# EAGLE design pcb_control_m128 (EAGLE 7.4.0)
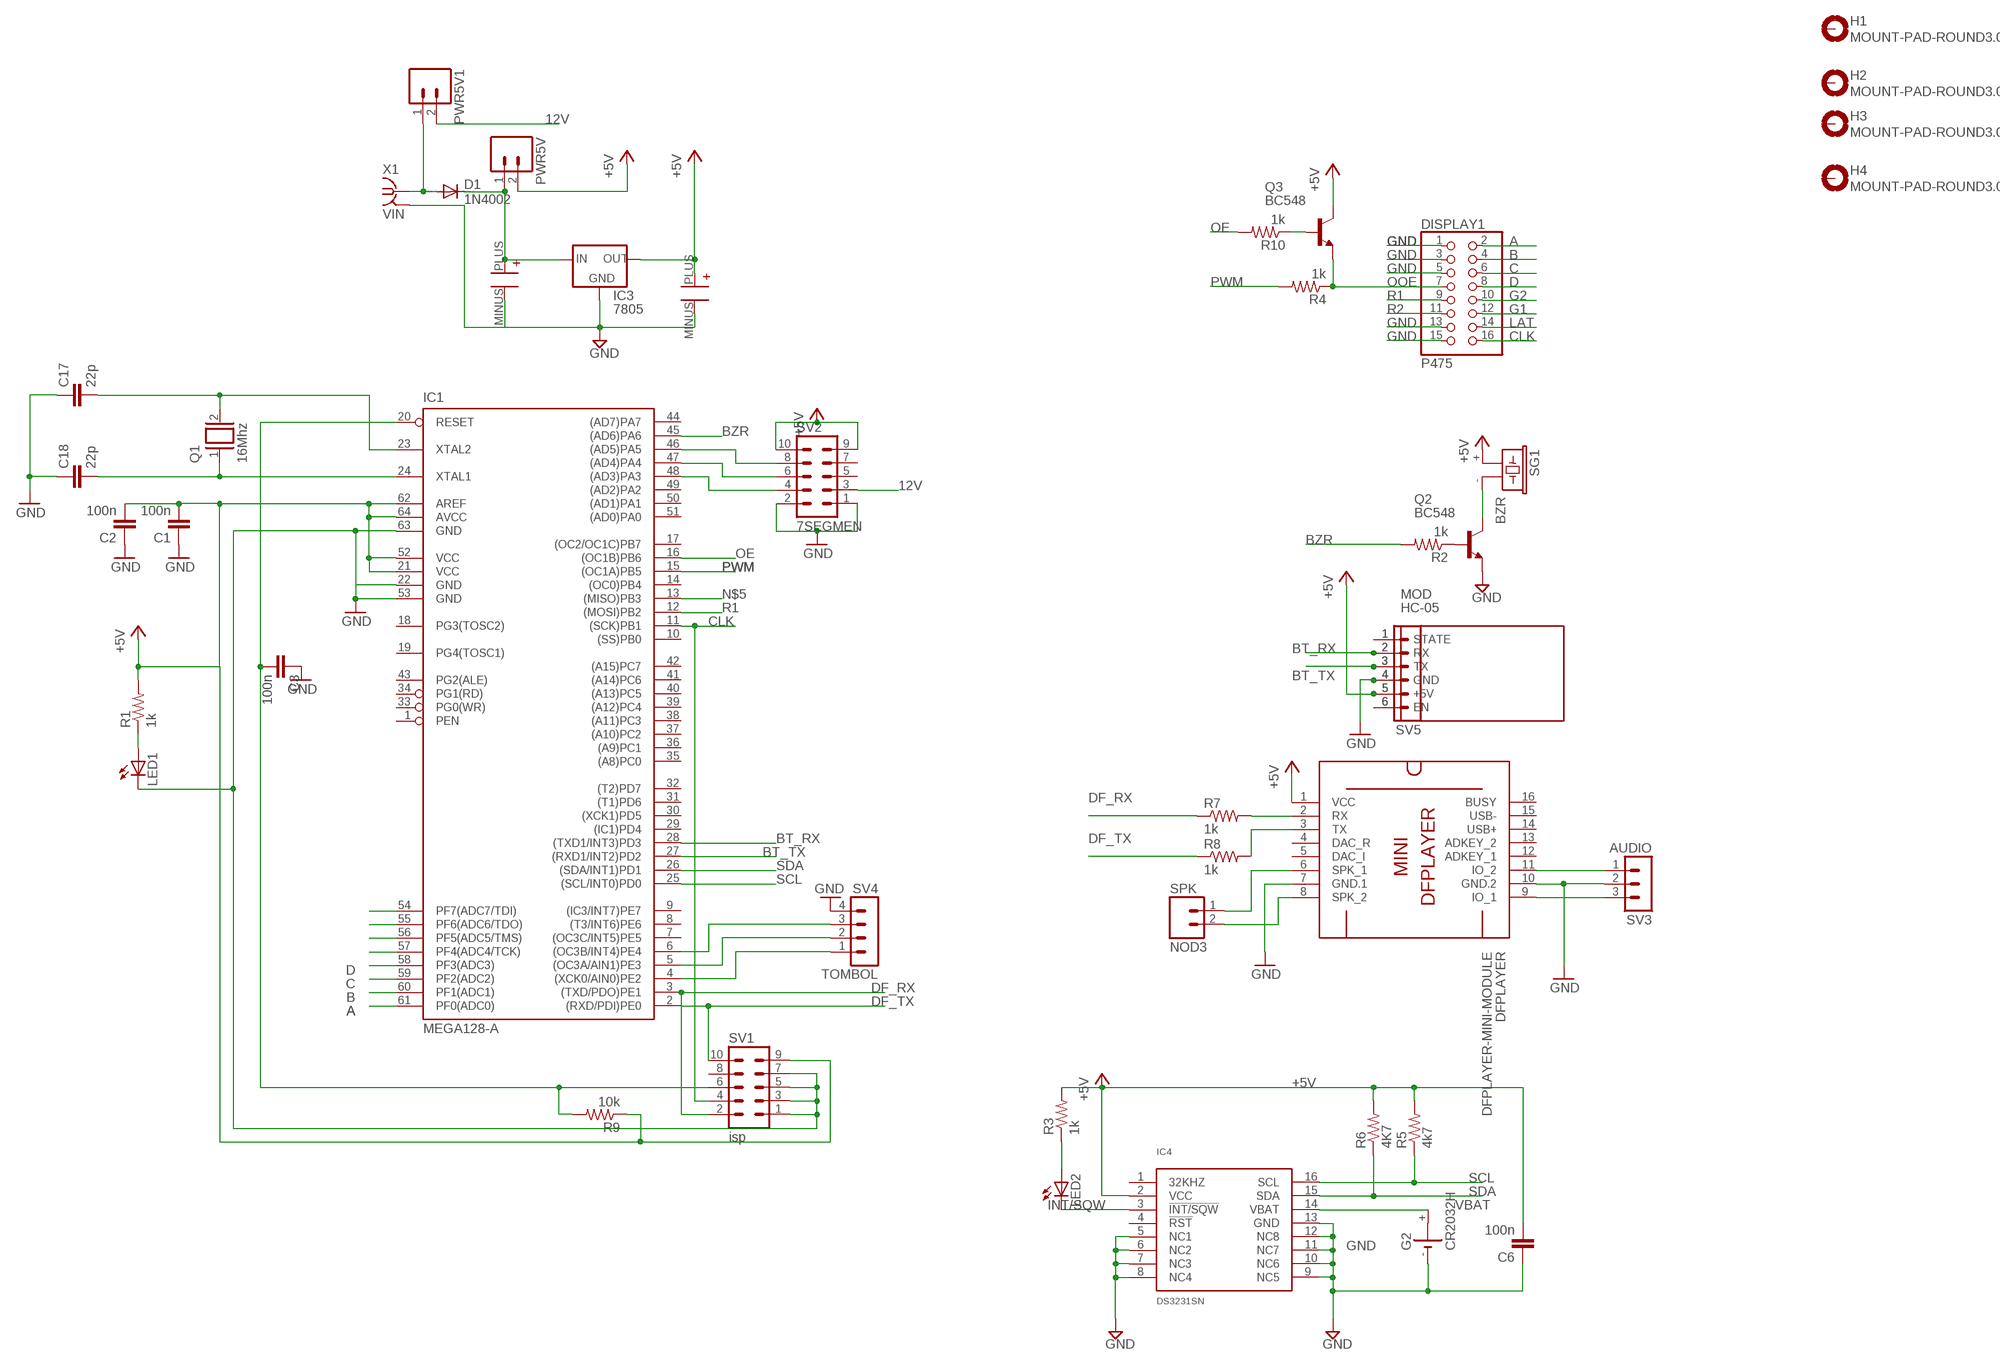
[diagram p0: schematic, sheet 1]

## Parts
C1  100n  C-EU025-024X044  [C025-024X044]
C2  100n  C-EU025-024X044  [C025-024X044]
C3  100n  C-EU025-024X044  [C025-024X044]
C6  100n  C-EU025-024X044  [C025-024X044]
C17  22p  C-EU025-024X044  [C025-024X044]
C18  22p  C-EU025-024X044  [C025-024X044]
C23  470U  EEU-FR1C471B  [EEU-FR1C471B]
C24  1000U  EEU-FR1C471B  [EEU-FR1C471B]
D1  1N4002  1N4148DO35-10  [DO35-10]
DFPLAYER  DFPLAYER-MINI-MODULE  [DFPLAYER-MINI-MODULE]
DISPLAY1  P475  PINHD-2X8  [2X08]
G2  CR2032H  [CR2032H]
H1  MOUNT-PAD-ROUND3.0  [3,0-PAD]
H2  MOUNT-PAD-ROUND3.0  [3,0-PAD]
H3  MOUNT-PAD-ROUND3.0  [3,0-PAD]
H4  MOUNT-PAD-ROUND3.0  [3,0-PAD]
IC1  MEGA128-A  [TQFP64]
IC3  7805  78XXS  [78XXS]
IC4  DS3231SN  [SO16W]
LED1  LED3MM  [LED3MM]
LED2  LED3MM  [LED3MM]
MOD  HC-05  WIRELESS-BLUETOOTH-HC-05  [WIRELESS-BLUETOOTH-HC-05]
NOD3  SPK  M02PTH  [1X02]
PWR5V  M02PTH  [1X02]
PWR5V1  M02PTH  [1X02]
Q1  16Mhz  XTAL/S  [QS]
Q2  BC548  [TO92-EBC]
Q3  BC548  [TO92-EBC]
R1  1k  RESISTORAXIAL-0.3  [AXIAL-0.3]
R2  1k  RESISTORAXIAL-0.3  [AXIAL-0.3]
R3  1k  RESISTORAXIAL-0.3  [AXIAL-0.3]
R4  1k  RESISTORAXIAL-0.3  [AXIAL-0.3]
R5  4k7  RESISTORAXIAL-0.3  [AXIAL-0.3]
R6  4K7  RESISTORAXIAL-0.3  [AXIAL-0.3]
R7  1k  RESISTORAXIAL-0.3  [AXIAL-0.3]
R8  1k  RESISTORAXIAL-0.3  [AXIAL-0.3]
R9  10k  RESISTORAXIAL-0.3  [AXIAL-0.3]
R10  1k  RESISTORAXIAL-0.3  [AXIAL-0.3]
SG1  BZR  F/CM12P  [F/CM12P]
SV1  isp  MA05-2  [MA05-2]
SV2  7SEGMEN  MA05-2  [MA05-2]
SV3  AUDIO  MA03-1  [MA03-1]
SV4  TOMBOL  MA04-1  [MA04-1]
SV5  MA06-1  [MA06-1]
X1  VIN  SMA-J502-ND  [J502-ND]

## Nets
5VPANEL [SUPPLYP]: C24.PLUS D1.C IC3.IN PWR5V.1
12V: PWR5V1.2 SV2.3
12V1: D1.A PWR5V1.1 X1.3 X1.4
+5V: C1.2 C2.2 C6.2 C23.PLUS DFPLAYER.1(VCC) IC1.21(VCC) IC1.52(VCC) IC1.62(AREF) IC1.64(AVCC) IC3.OUT IC4.2(VCC) MOD.5(+5V) PWR5V.2 Q3.C R1.P$2 R3.P$2 R5.P$2 R6.P$2 R9.P$1 SG1.+ SV1.9 SV2.9 SV2.10 SV5.5
A: DISPLAY1.2 IC1.61(PF0(ADC0))
B: DISPLAY1.4 IC1.60(PF1(ADC1))
BT_RX: IC1.28((TXD1/INT3)PD3) MOD.2(RX) SV5.2
BT_TX: IC1.27((RXD1/INT2)PD2) MOD.3(TX) SV5.3
BZR: IC1.45((AD6)PA6) R2.P$2
C: DISPLAY1.6 IC1.59(PF2(ADC2))
CLK: DISPLAY1.16 IC1.11((SCK)PB1) SV1.4
D: DISPLAY1.8 IC1.58(PF3(ADC3))
DF_RX: IC1.3((TXD/PDO)PE1) R7.P$1 SV1.2
DF_TX: IC1.2((RXD/PDI)PE0) R8.P$1 SV1.10
G1: DISPLAY1.12
G2: DISPLAY1.10
GND: C1.1 C2.1 C3.1 C6.1 C17.1 C18.1 C23.MINUS C24.MINUS DFPLAYER.7(GND.1) DFPLAYER.10(GND.2) DISPLAY1.1 DISPLAY1.3 DISPLAY1.5 DISPLAY1.13 DISPLAY1.15 G2.- IC1.22(GND) IC1.53(GND) IC1.63(GND) IC3.GND IC4.5(NC1) IC4.6(NC2) IC4.7(NC3) IC4.8(NC4) IC4.9(NC5) IC4.10(NC6) IC4.11(NC7) IC4.12(NC8) IC4.13(GND) LED1.K(C) MOD.4(GND) Q2.E SV1.1 SV1.3 SV1.5 SV1.7 SV2.1 SV2.2 SV3.2 SV4.4 SV5.4 X1.2 X1.5
INT/SQW: IC4.3(!INT/SQW) LED2.K(C)
LAT: DISPLAY1.14 IC1.57(PF4(ADC4/TCK))
N$1: Q2.B R2.P$1
N$2: Q2.C SG1.-
N$3: LED2.A R3.P$1
N$4: C3.2 IC1.20(RESET) R9.P$2 SV1.6
N$5: IC1.13((MISO)PB3)
N$6: MOD.1(STATE) SV5.1
N$7: LED1.A R1.P$1
N$8: DFPLAYER.2(RX) R7.P$2
N$9: DFPLAYER.3(TX) R8.P$2
N$10: Q3.B R10.P$1
N$11: MOD.6(EN) SV5.6
N$12: IC1.48((AD3)PA3) SV2.4
N$13: IC1.47((AD4)PA4) SV2.6
N$14: IC1.46((AD5)PA5) SV2.8
N$15: IC1.4((XCK0/AIN0)PE2) SV4.1
N$16: IC1.5((OC3A/AIN1)PE3) SV4.2
N$18: IC1.6((OC3B/INT4)PE4) SV4.3
N$21: DFPLAYER.6(SPK_1) NOD3.1
N$22: DFPLAYER.8(SPK_2) NOD3.2
N$23: DFPLAYER.9(IO_1) SV3.3
N$24: DFPLAYER.11(IO_2) SV3.1
N$59: IC1.56(PF5(ADC5/TMS))
N$60: IC1.55(PF6(ADC6/TDO))
N$61: IC1.54(PF7(ADC7/TDI))
N$95 [OSC]: C17.2 IC1.23(XTAL2) Q1.2
N$96 [OSC]: C18.2 IC1.24(XTAL1) Q1.1
OE: IC1.16((OC1B)PB6) R10.P$2
OOE: DISPLAY1.7 Q3.E R4.P$1
PWM: IC1.15((OC1A)PB5) R4.P$2
R1: DISPLAY1.9 IC1.12((MOSI)PB2)
R2: DISPLAY1.11
SCL: IC1.25((SCL/INT0)PD0) IC4.16(SCL) R5.P$1
SDA: IC1.26((SDA/INT1)PD1) IC4.15(SDA) R6.P$1
VBAT: G2.+ IC4.14(VBAT)
Unconnected: DFPLAYER.4(DAC_R) DFPLAYER.5(DAC_I) DFPLAYER.12(ADKEY_1) DFPLAYER.13(ADKEY_2) DFPLAYER.14(USB+) DFPLAYER.15(USB-) DFPLAYER.16(BUSY) H1.B3,0(MOUNT) H2.B3,0(MOUNT) H3.B3,0(MOUNT) H4.B3,0(MOUNT) IC1.1(PEN) IC1.7((OC3C/INT5)PE5) IC1.8((T3/INT6)PE6) IC1.9((IC3/INT7)PE7) IC1.10((SS)PB0) IC1.14((OC0)PB4) IC1.17((OC2/OC1C)PB7) IC1.18(PG3(TOSC2)) IC1.19(PG4(TOSC1)) IC1.29((IC1)PD4) IC1.30((XCK1)PD5) IC1.31((T1)PD6) IC1.32((T2)PD7) IC1.33(PG0(WR)) IC1.34(PG1(RD)) IC1.35((A8)PC0) IC1.36((A9)PC1) IC1.37((A10)PC2) IC1.38((A11)PC3) IC1.39((A12)PC4) IC1.40((A13)PC5) IC1.41((A14)PC6) IC1.42((A15)PC7) IC1.43(PG2(ALE)) IC1.44((AD7)PA7) IC1.49((AD2)PA2) IC1.50((AD1)PA1) IC1.51((AD0)PA0) IC4.1(32KHZ) IC4.4(!RST) SV1.8 SV2.5 SV2.7

## Library data of the parts
C1-C3 C6 C17 C18 = rcl:C-EU: CAPACITOR, European symbol
C23 C24 = my:EEU-FR1C471B
D1 = diode:1N4148: DIODE high speed (Philips)
DFPLAYER = diy-modules:DFPLAYER-MINI-MODULE: DFPlayer Mini - MP3 player module based on YX5200 chip More details available here: https://www.dfrobot.com/wiki/index.php/DFPlayer_Mini_SKU:DFR0299 Click here to find device on ebay.com <http://www.ebay.com/sch/dfplayer+mini>
DISPLAY1 = pinhead:PINHD-2X8: PIN HEADER
G2 = battery_cr2032:CR2032H: LI BATTERY Varta
H1-H4 = holes:MOUNT-PAD-ROUND: MOUNTING PAD, round
IC1 = atmel:MEGA128: MICROCONTROLLER 128 Kbytes FLASH 4 Kbytes SRAM 4 Kbytes EEPROM DUAL USART 8-channel 10 bit ADC Source: avr.lbr; MPN: ATMEGA128-16AU; OC_FARNELL: 9171118; OC_NEWARK: 95K7364
IC3 = v-reg:78XXS: VOLTAGE REGULATOR
IC4 = comfile:DS3231SN
LED1 LED2 = adafruit:LED: LED OSRAM: - CHIPLED LG R971, LG N971, LY N971, LG Q971, LY Q971, LO R971, LY R971 LH N974, LH R974 LS Q976, LO Q976, LY Q976 LO Q996 - Hyper CHIPLED LW Q18S LB Q993, LB Q99A, LB R99A - SideLED LS A670, LO A670, LY A670, LG A670, LP A670 LB A673, LV A673, LT A673, LW A673 LH A674 LY A675 LS A676, LA A676, LO A676, LY A676, LW A676 LS A679, LY A679, LG A679 - Hyper Micro SIDELED® LS Y876, LA Y876, LO Y876, LY Y876 LT Y87S - SmartLED LW L88C, LW L88S LB L89C, LB L89S, LG L890 LS L89K, LO L89K, LY L89K LS L896, LA L896, LO L896, LY L896 - TOPLED LS T670, LO T670, LY T670, LG T670, LP T670 LSG T670, LSP T670, LSY T670, LOP T670, LYG T670 LG T671, LOG T671, LSG T671 LB T673, LV T673, LT T673, LW T673 LH T674 LS T676, LA T676, LO T676, LY T676, LB T676, LH T676, LSB T676, LW T676 LB T67C, LV T67C, LT T67C, LS T67K, LO T67K, LY T67K, LW E67C LS E67B, LA E67B, LO E67B, LY E67B, LB E67C, LV E67C, LT E67C LW T67C LS T679, LY T679, LG T679 LS T770, LO T770, LY T770, LG T770, LP T770 LB T773, LV T773, LT T773, LW T773 LH T774 LS E675, LA E675, LY E675, LS T675 LS T776, LA T776, LO T776, LY T776, LB T776 LHGB T686 LT T68C, LB T68C - Hyper Mini TOPLED® LB M676 - Mini TOPLED Santana® LG M470 LS M47K, LO M47K, LY M47K Source: http://www.osram.convergy.de/
MOD = diy-modules:WIRELESS-BLUETOOTH-HC-05: Bluetooth Transceiver Module based on HC-05 board Tutorial is available here: https://arduino-info.wikispaces.com/BlueTooth-HC05-HC06-Modules-How-To Click here to find device on ebay.com <http://www.ebay.com/sch/hc-05+module+rs232>
NOD3 PWR5V PWR5V1 = SparkFun-Connectors:M02: Standard 2-pin 0.1" header. Use with - straight break away headers ( PRT-00116) - right angle break away headers (PRT-00553) - swiss pins (PRT-00743) - machine pins (PRT-00117) - female headers (PRT-00115) Molex polarized connector foot print use with: PRT-08233 with associated crimp pins and housings. 2.54_SCREWTERM for use with PRT-10571. 3.5mm Screw Terminal footprints for PRT-08084 5mm Screw Terminal footprints for use with PRT-08432
Q1 = special:XTAL/S: CRYSTAL
Q2 Q3 = transistor-npn:BC548*: NPN Transistor
R1-R10 = SparkFun-Passives:RESISTOR: Resistor Basic schematic elements and footprints for 0603, 1206, and PTH resistors.
SG1 = buzzer:F/CM12P: BUZZER Source: Buerklin; OC_FARNELL: unknown; OC_NEWARK: unknown
SV1 SV2 = con-lstb:MA05-2: PIN HEADER; OC_FARNELL: unknown; OC_NEWARK: unknown
SV3 = con-lstb:MA03-1: PIN HEADER; OC_FARNELL: unknown; OC_NEWARK: unknown
SV4 = con-lstb:MA04-1: PIN HEADER; OC_FARNELL: unknown; OC_NEWARK: unknown
SV5 = con-lstb:MA06-1: PIN HEADER; OC_FARNELL: unknown; OC_NEWARK: unknown
X1 = con-coax:SMA-: SMA 50 Ohm End Launch Jack Receptacle - Round Contact Johnson Components Source: www.johnsoncomponents.com .. J502-ND.pdf; OC_FARNELL: unknown; OC_NEWARK: unknown

## Net classes
0 default: width 0.254 mm, drill 0.381 mm, clearance 0.254 mm
1 SUPPLY: width 0.762 mm, drill 0.762 mm, clearance 0.254 mm to class 0, clearance 0.254 mm
2 SUPPLYP: width 0.762 mm, drill 0.762 mm, clearance 0.254 mm to class 0, clearance 0.254 mm to class 1, clearance 0.254 mm
3 OSC: width 0.254 mm, drill 0.381 mm, clearance 0.381 mm to class 0, clearance 0.381 mm to class 1, clearance 0.381 mm to class 2, clearance 0.381 mm

## Board
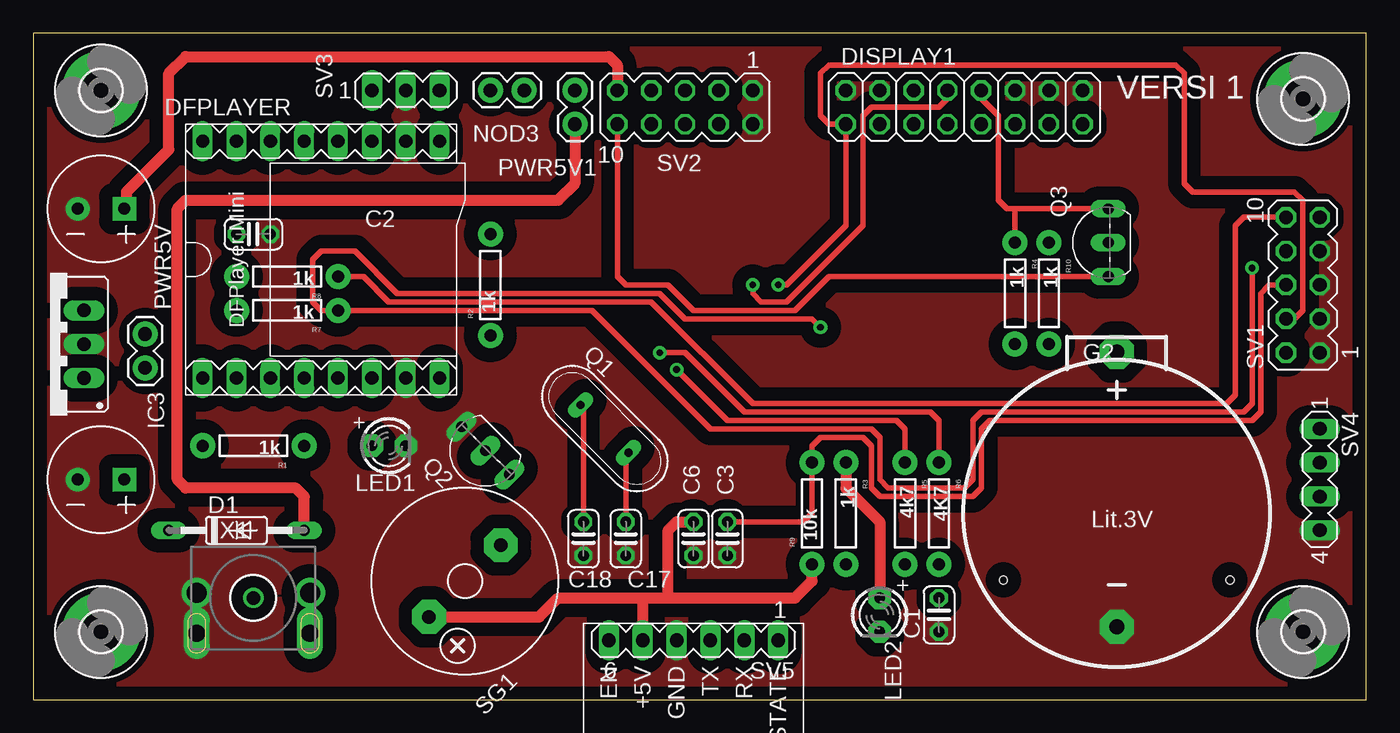
[diagram p1: board, top side]
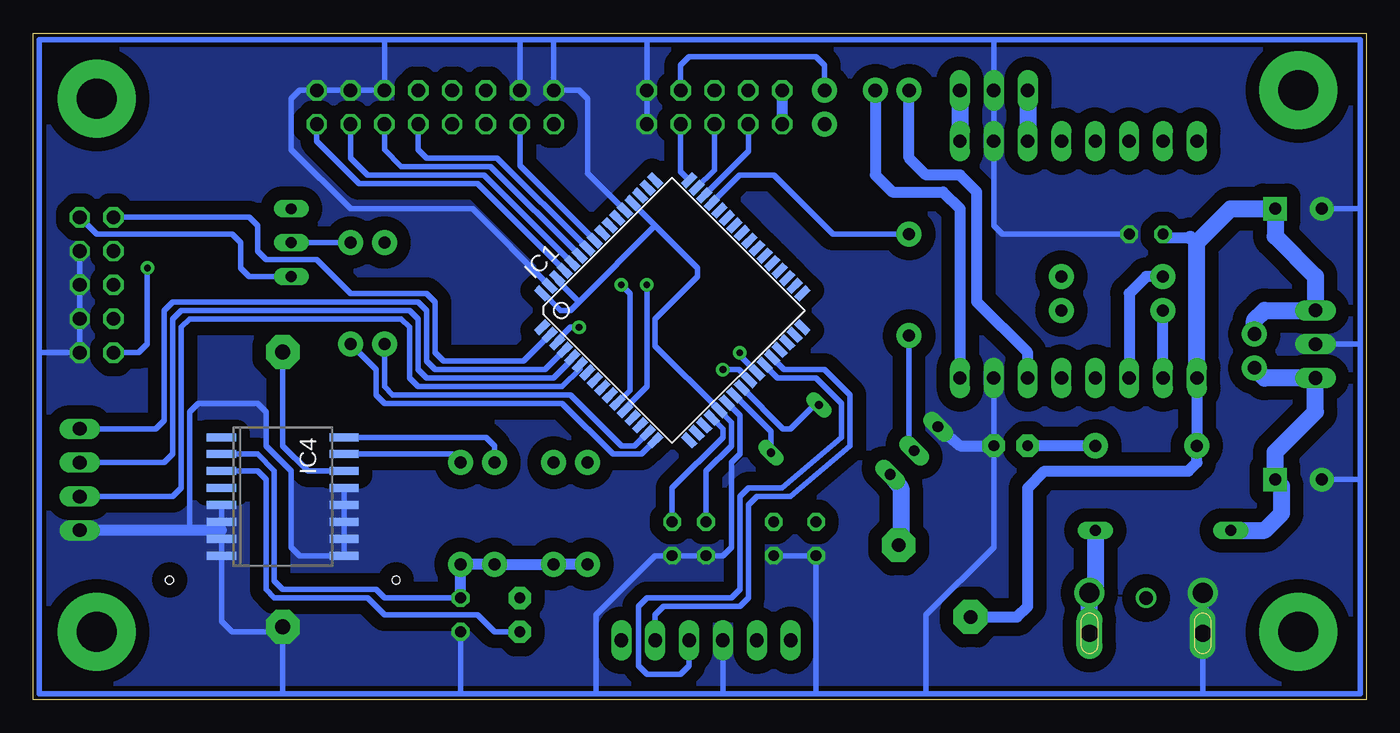
[diagram p2: board, bottom side, seen from below]

Size 100 x 50 mm. Coordinates in mm from the lower left corner, seen from the top.
Outline: 0,0 100,0 100,50 0,50 0,0
Copper layers (1*16): Top 0.035mm / dielectric 1.5mm / Bottom 0.035mm
Design rules "default": minimum track width 10mil, minimum drill 24mil, track to track 8mil, track to pad 8mil, pad to pad 8mil, via to via 8mil, smd to smd 8mil, copper to edge 40mil, drill to drill 8mil, minimum pad ring 10mil, minimum via ring 8mil, stop-mask expansion 4mil, vias tented up to drill 0mil, thermal gap 10mil

### Footprints (pad centres in the part's own frame; a part is rotated, then mirrored left to right if it is on the bottom)
C025-024X044 = drill 0.813 octagon: 1 -1.27,0; 2 1.27,0
EEU-FR1C471B = drill 0.9 pad 1.778: MINUS 1.75,0 | drill 0.9 pad 1.778 square: PLUS -1.75,0
DO35-10 = drill 0.813 long: A 5.08,0; C -5.08,0
DFPLAYER-MINI-MODULE = drill 1 long: 1 -8.89,-8.89; 2 -6.35,-8.89; 3 -3.81,-8.89; 4 -1.27,-8.89; 5 1.27,-8.89; 6 3.81,-8.89; 7 6.35,-8.89; 8 8.89,-8.89; 9 8.89,8.89; 10 6.35,8.89; 11 3.81,8.89; 12 1.27,8.89; 13 -1.27,8.89; 14 -3.81,8.89; 15 -6.35,8.89; 16 -8.89,8.89
2X08 = drill 1.016 octagon: 1 -8.89,-1.27; 2 -8.89,1.27; 3 -6.35,-1.27; 4 -6.35,1.27; 5 -3.81,-1.27; 6 -3.81,1.27; 7 -1.27,-1.27; 8 -1.27,1.27; 9 1.27,-1.27; 10 1.27,1.27; 11 3.81,-1.27; 12 3.81,1.27; 13 6.35,-1.27; 14 6.35,1.27; 15 8.89,-1.27; 16 8.89,1.27
CR2032H = drill 1.118 pad 2.54 octagon: + 0,12.1; - 0,-8.5 | hole 0.6: -8.5,-5; 8.5,-5
3,0-PAD = drill 3 pad 5.842: B3,0 0,0
TQFP64 = smd 1.194 x 0.559: 1 -7.8,6; 2 -7.8,5.2; 3 -7.8,4.4; 4 -7.8,3.6; 5 -7.8,2.8; 6 -7.8,2; 7 -7.8,1.2; 8 -7.8,0.4; 9 -7.8,-0.4; 10 -7.8,-1.2; 11 -7.8,-2; 12 -7.8,-2.8; 13 -7.8,-3.6; 14 -7.8,-4.4; 15 -7.8,-5.2; 16 -7.8,-6; 33 7.8,-6; 34 7.8,-5.2; 35 7.8,-4.4; 36 7.8,-3.6; 37 7.8,-2.8; 38 7.8,-2; 39 7.8,-1.2; 40 7.8,-0.4; 41 7.8,0.4; 42 7.8,1.2; 43 7.8,2; 44 7.8,2.8; 45 7.8,3.6; 46 7.8,4.4; 47 7.8,5.2; 48 7.8,6 | smd 0.559 x 1.194: 17 -6,-7.8; 18 -5.2,-7.8; 19 -4.4,-7.8; 20 -3.6,-7.8; 21 -2.8,-7.8; 22 -2,-7.8; 23 -1.2,-7.8; 24 -0.4,-7.8; 25 0.4,-7.8; 26 1.2,-7.8; 27 2,-7.8; 28 2.8,-7.8; 29 3.6,-7.8; 30 4.4,-7.8; 31 5.2,-7.8; 32 6,-7.8; 49 6,7.8; 50 5.2,7.8; 51 4.4,7.8; 52 3.6,7.8; 53 2.8,7.8; 54 2,7.8; 55 1.2,7.8; 56 0.4,7.8; 57 -0.4,7.8; 58 -1.2,7.8; 59 -2,7.8; 60 -2.8,7.8; 61 -3.6,7.8; 62 -4.4,7.8; 63 -5.2,7.8; 64 -6,7.8
78XXS = drill 1.016 long: GND 0,-2.54; IN -2.54,-2.54; OUT 2.54,-2.54
SO16W = smd 0.6 x 2.2: 1 -4.445,-4.6; 2 -3.175,-4.6; 3 -1.905,-4.6; 4 -0.635,-4.6; 5 0.635,-4.6; 6 1.905,-4.6; 7 3.175,-4.6; 8 4.445,-4.6; 9 4.445,4.6; 10 3.175,4.6; 11 1.905,4.6; 12 0.635,4.6; 13 -0.635,4.6; 14 -1.905,4.6; 15 -3.175,4.6; 16 -4.445,4.6
LED3MM = drill 0.813 pad 1.676 octagon: A -1.27,0; K 1.27,0
WIRELESS-BLUETOOTH-HC-05 = drill 1 long: 1 -6.35,-17.145; 2 -3.81,-17.145; 3 -1.27,-17.145; 4 1.27,-17.145; 5 3.81,-17.145; 6 6.35,-17.145
1X02 = drill 1.016 pad 1.88: 1 0,0; 2 2.54,0
QS = drill 0.61 long: 1 -2.54,0; 2 2.54,0
TO92-EBC = drill 0.813 long: B 0,-1.27; C -2.54,-1.27; E 2.54,-1.27
AXIAL-0.3 = drill 0.9 pad 1.88: P$1 -3.81,0; P$2 3.81,0
F/CM12P = drill 1.016 pad 2.54 octagon: + 3.81,0; - -3.81,0
MA05-2 = drill 1.016 octagon: 1 -5.08,-1.27; 2 -5.08,1.27; 3 -2.54,-1.27; 4 -2.54,1.27; 5 0,-1.27; 6 0,1.27; 7 2.54,-1.27; 8 2.54,1.27; 9 5.08,-1.27; 10 5.08,1.27
MA03-1 = drill 1.016 long: 1 -2.54,0; 2 0,0; 3 2.54,0
MA04-1 = drill 1.016 long: 1 -3.81,0; 2 -1.27,0; 3 1.27,0; 4 3.81,0
MA06-1 = drill 1.016 long: 1 -6.35,0; 2 -3.81,0; 3 -1.27,0; 4 1.27,0; 5 3.81,0; 6 6.35,0
J502-ND = drill 1: 1 0,0 | drill 1.5: 2 -4.25,0.4; 3 4.25,0.4 | drill 1.3 long: 4 4.25,-2.65; 5 -4.25,-2.65

### Placement (x,y rotation side)
C1  67.94,6.35 90 top
C2  16.51,34.92 180 top
C3  52.07,12.06 90 top
C6  49.53,12.06 90 top
C17  44.45,12.06 90 top
C18  41.27,12.06 90 top
C23  5.08,36.83 180 top
C24  5.08,16.51 180 top
D1  15.24,12.7 0 top
DFPLAYER  21.59,33.02 0 top
DISPLAY1  69.85,44.45 180 top
G2  81.28,13.97 0 top
H1  95.25,5.08 0 top
H2  5.08,45.72 0 top
H3  95.25,45.09 0 top
H4  5.08,5.08 0 top
IC1  52.07,29.21 45 bottom
IC3  1.27,26.67 90 top
IC4  81.28,15.24 270 bottom
LED1  26.67,19.05 0 top
LED2  63.5,6.35 270 top
MOD  49.53,-12.7 180 top
NOD3  34.29,45.72 0 top
PWR5V  8.38,24.89 90 top
PWR5V1  40.64,43.18 90 top
Q1  42.86,20.32 315 top
Q2  33.02,17.78 135 top
Q3  79.38,34.29 90 top
R1  16.51,19.05 180 top
R2  34.29,31.11 90 top
R3  60.96,13.97 270 top
R4  73.66,30.48 270 top
R5  65.41,13.97 270 top
R6  67.94,13.97 270 top
R7  19.05,29.21 180 top
R8  19.05,31.75 180 top
R9  58.42,13.97 90 top
R10  76.2,30.48 270 top
SG1  32.38,8.89 225 top
SV1  95.25,31.11 90 top
SV2  48.9,44.45 180 top
SV3  27.94,45.72 0 top
SV4  96.52,16.51 270 top
SV5  49.53,4.45 180 top
X1  16.51,7.62 0 top

### Tracks (layer width: path | path; a pad name or v marks a point on that pad's centre or on a via)
5VPANEL
  Bottom 1.27: D1.C 7.62,12.7 6.35,13.97 6.35,16.03 C24.PLUS 6.83,18.57 3.81,21.59 IC3.IN 7.62,24.13 PWR5V.1
12V
  Bottom 0.406: PWR5V1.2 40.64,47.62 41.27,48.26 50.8,48.26 51.44,47.62 SV2.3
12V1
  Top 0.813: D1.A 20.32,15.24 19.68,15.88 11.43,15.88 10.79,16.51 10.79,36.83 11.43,37.47 39.37,37.47 40.64,38.73 PWR5V1.1
  Bottom 1.27: D1.A 20.32,8.46 X1.3 X1.4
+5V
  Top 0.406: Q3.C 59.69,31.75 57.15,29.21 49.53,29.21 47.62,31.11 44.45,31.11 43.81,31.75 SV2.10
  Top 0.813: SG1.+ 37.95,6.2 39.37,7.62 45.72,7.62 | 45.72,7.62 SV5.5 | 45.72,7.62 47.62,7.62 | 47.62,7.62 57.15,7.62 58.42,8.89 R9.P$1 | 47.62,7.62 47.62,12.7 48.26,13.34 C6.2 | C23.PLUS 6.99,36.98 6.99,38.1 10.16,41.27 10.16,46.99 11.43,48.26 43.18,48.26 43.81,47.62 SV2.9
  Bottom 0.254: 61.85,30.61 IC1.64 | C2.2 14.99,34.67
  Bottom 0.406: C6.2 49.53,17.14 47.62,19.05 47.62,20.8 IC1.21 53.34,26.52 53.34,28.57 50.16,31.75 50.16,32.38 53.34,35.56 | IC4.2 83.19,18.41 81.92,17.14 81.92,8.89 81.28,8.26 74.3,8.26 73.66,7.62 C1.2 | IC1.52 53.34,35.56 | 53.34,35.56 59.05,29.84 | SV1.9 95.25,34.92 85.09,34.92 84.45,34.29 84.45,32.38 83.82,31.75 Q3.C | 61.85,30.61 60.45,29.21 59.69,29.21 59.05,29.84 | IC1.62 60.7,31.49 59.05,29.84
  Bottom 0.813: DFPLAYER.1 R1.P$2 12.7,17.78 13.34,17.14 24.13,17.14 25.4,15.88 25.4,6.99 26.19,6.2 SG1.+ | R9.P$1 R3.P$2 R5.P$2 R6.P$2 C1.2 | 14.99,34.67 13.21,34.67 | SV2.9 SV2.10
  Bottom 1.016: 13.21,34.67 12.7,34.29
  Bottom 1.27: PWR5V.2 8.38,28.45 7.62,29.21 IC3.OUT 3.81,31.75 6.83,34.77 C23.PLUS 10.16,36.83 12.7,34.29 DFPLAYER.1
A
  Bottom 0.406: DISPLAY1.2 78.74,41.91 75.56,38.73 66.69,38.73 IC1.61
B
  Bottom 0.406: DISPLAY1.4 76.2,40.64 74.93,39.37 66.19,39.37 IC1.60
BT_RX
  Bottom 0.406: IC1.28 43.66,24.77 40.64,24.77 38.73,22.86 38.73,19.05 43.18,15.24 45.72,15.24 46.35,14.61 46.35,7.62 46.99,6.99 52.7,6.99 53.34,6.35 SV5.2
BT_TX
  Bottom 0.406: IC1.27 44.16,24.13 41.27,24.13 39.37,22.23 39.37,19.68 43.81,15.88 46.35,15.88 46.99,15.24 46.99,8.26 47.62,7.62 53.98,7.62 54.61,6.99 54.61,2.54 53.98,1.91 51.44,1.91 50.8,2.54 SV5.3
BZR
  Bottom 0.406: R2.P$2 40.01,34.92 44.45,39.37 47,39.37 IC1.45
C
  Bottom 0.406: DISPLAY1.6 73.66,41.27 72.39,40.01 65.69,40.01 IC1.59
CLK  (via drill 0.5 pad 1.02)
  Top 0.406: SV1.4 94.61,28.57 95.25,29.21 95.25,37.47 94.61,38.1 87,38.1 86.36,38.73 86.36,46.99 85.72,47.62 59.69,47.62 59.05,46.99 59.05,43.81 59.69,43.18 DISPLAY1.16 60.96,35.56 56.52,31.11 v55.88,31.11
  Bottom 0.406: IC1.11 55.24,23.21 55.24,30.48 v55.88,31.11
D
  Bottom 0.406: DISPLAY1.8 71.12,41.27 70.48,40.64 65.2,40.64 IC1.58
DF_RX  (via drill 0.5 pad 1.02)
  Top 0.406: v91.44,32.38 91.44,22.23 90.81,21.59 71.12,21.59 70.48,20.95 70.48,16.51 69.85,15.88 64.14,15.88 63.5,16.51 63.5,19.68 62.87,20.32 50.8,20.32 41.91,29.21 R7.P$1 21.59,29.21 20.95,29.84 20.95,33.02 21.59,33.66 24.13,33.66 27.3,30.48 46.99,30.48 48.9,28.57 58.42,28.57 v59.05,27.94
  Bottom 0.406: SV1.2 92.08,26.04 91.44,26.67 v91.44,32.38 | IC1.3 60.7,26.93 59.69,27.94 v59.05,27.94
DF_TX
  Top 0.406: R8.P$1 24.77,31.75 26.67,29.84 46.35,29.84 53.98,22.23 89.53,22.23 90.17,22.86 90.17,35.56 90.81,36.2 SV1.10
  Bottom 0.254: 61.21,27.43 IC1.2
  Bottom 0.406: SV1.10 83.82,36.2 83.19,35.56 83.19,33.66 82.55,33.02 78.74,33.02 76.2,30.48 70.48,30.48 69.85,29.84 69.85,26.04 69.22,25.4 63.23,25.4 IC1.2
GND
  Bottom 0.406: 60.96,49.53 DISPLAY1.15 59.05,45.72 58.42,45.09 58.42,39.52 IC1.53 | 60.96,49.53 63.5,49.53 | 63.5,49.53 73.66,49.53 | 73.66,49.53 99.55,49.53 99.55,26.04 | 99.55,26.04 99.55,0.45 81.28,0.45 | 81.28,0.45 67.94,0.45 | 67.94,0.45 57.78,0.45 | 57.78,0.45 48.26,0.45 | 48.26,0.45 41.27,0.45 | 41.27,0.45 33.02,0.45 | 33.02,0.45 12.26,0.45 | 12.26,0.45 0.45,0.45 0.45,16.51 | 0.45,16.51 0.45,26.67 | 0.45,26.67 0.45,36.83 | 0.45,36.83 0.45,49.53 27.94,49.53 | 27.94,49.53 53.98,49.53 | 53.98,49.53 60.96,49.53 | 27.94,49.53 SV3.2 DFPLAYER.10 27.94,35.56 27.3,34.92 C2.1 | 73.66,49.53 DISPLAY1.5 DISPLAY1.3 DISPLAY1.1 80.01,45.72 80.64,45.09 80.64,41.27 76.2,36.83 67.04,36.83 IC1.63 | DISPLAY1.13 63.5,49.53 | C23.MINUS 0.45,36.83 | IC3.GND 0.45,26.67 | C24.MINUS 0.45,16.51 | SV1.7 SV1.5 SV1.3 SV1.1 99.55,26.04 | 48.26,0.45 SV5.4 48.26,5.08 | X1.5 12.26,0.45 | DFPLAYER.7 LED1.K 27.94,11.43 33.02,6.35 33.02,0.45 | IC4.5 IC4.6 85.88,12.7 IC4.7 IC4.8 85.88,5.87 85.09,5.08 81.67,5.08 G2.- 81.28,0.45 | IC4.13 IC4.12 IC4.11 IC4.10 IC4.9 80.01,10.79 80.64,11.43 80.64,17.14 82.55,19.05 82.55,21.59 83.19,22.23 87.63,22.23 88.27,21.59 88.27,12.7 | C1.1 67.94,0.45 | IC1.22 46.99,21.3 46.99,18.41 47.62,17.78 47.62,11.43 48.26,10.79 C6.1 | C6.1 53.34,10.79 57.78,6.35 57.78,0.45 | 41.27,0.45 C18.1 C17.1 | C3.1 C6.1 | SV2.2 SV2.1 53.98,49.53
  Bottom 0.813: X1.2 X1.5 | Q2.E 30.48,19.05 LED1.K | 85.88,12.7 88.27,12.7 SV4.4
  pour Bottom (isolate 1.016, no thermals): 0,50 0,0 100,0 100,50
  pour Top (isolate 1.016, no thermals): 0,50 0,0 100,0 100,50
INT/SQW
  Bottom 0.406: IC4.3 83.19,17.14 82.55,16.51 82.55,8.26 81.92,7.62 74.93,7.62 73.66,6.35 66.67,6.35 65.41,5.08 LED2.K
LAT
  Bottom 0.406: IC1.57 63.5,40.07 DISPLAY1.14
N$1
  Bottom 0.406: R2.P$1 34.29,19.05 Q2.B
N$2
  Bottom 1.27: Q2.C 34.92,15.88 34.92,11.74 SG1.-
N$3
  Top 0.813: R3.P$1 60.96,15.88 63.5,13.34 LED2.A
N$4
  Top 0.406: C3.2 57.78,13.34 58.42,13.97 R9.P$2 58.42,19.05 59.05,19.68 62.23,19.68 62.87,19.05 62.87,15.88 63.5,15.24 70.48,15.24 71.12,15.88 71.12,20.32 71.75,20.95 91.44,20.95 92.08,21.59 92.08,30.48 92.71,31.11 SV1.6
  Bottom 0.406: IC1.20 48.27,20.32 48.26,20.32 48.26,19.68 52.07,15.88 C3.2
N$7
  Bottom 0.813: R1.P$1 LED1.A
N$8
  Bottom 0.813: DFPLAYER.2 R7.P$2
N$9
  Bottom 0.813: R8.P$2 16.51,31.75 17.78,30.48 DFPLAYER.3
N$10
  Bottom 0.406: R10.P$1 Q3.B
N$12
  Bottom 0.406: SV2.4 51.44,39.61 IC1.48
N$13
  Bottom 0.406: SV2.6 48.9,39.74 IC1.47
N$14
  Bottom 0.406: SV2.8 46.35,41.15 IC1.46
N$15
  Bottom 0.406: IC1.4 60.13,26.23 61.59,24.77 69.85,24.77 70.48,25.4 70.48,29.21 71.12,29.84 89.53,29.84 90.17,29.21 90.17,20.95 90.81,20.32 SV4.1
N$16
  Bottom 0.406: IC1.5 59.56,25.52 60.96,24.13 70.48,24.13 71.12,24.77 71.12,28.57 71.75,29.21 88.9,29.21 89.53,28.57 89.53,18.41 90.17,17.78 SV4.2
N$18
  Bottom 0.406: IC1.6 59,24.82 60.33,23.5 71.12,23.5 71.75,24.13 71.75,27.94 72.39,28.57 88.27,28.57 88.9,27.94 88.9,15.88 89.53,15.24 SV4.3
N$21
  Bottom 0.813: DFPLAYER.6 25.4,26.04 29.21,29.84 29.21,38.1 30.48,39.37 33.02,39.37 34.29,40.64 NOD3.1
N$22
  Bottom 0.813: NOD3.2 36.83,39.37 35.56,38.1 31.75,38.1 30.48,36.83 DFPLAYER.8
N$23
  Bottom 1.27: SV3.3 DFPLAYER.9
N$24
  Bottom 1.27: SV3.1 DFPLAYER.11
N$95
  Top 0.406: C17.2 44.45,18.32 Q1.2
  Bottom 0.406: IC1.23 44.66,20.1 Q1.2
N$96
  Top 0.406: Q1.1 41.27,21.69 C18.2
  Bottom 0.406: IC1.24 43.75,20.32 43.18,20.32 41.38,22.12 Q1.1
OE
  Bottom 0.406: IC1.16 54.38,18.41 56.52,18.41 60.33,22.23 73.66,22.23 74.3,22.86 74.3,24.77 R10.P$2
OOE
  Top 0.406: DISPLAY1.7 71.12,45.09 72.39,43.81 72.39,37.47 73.03,36.83 73.66,36.83 | 73.66,36.83 Q3.E | R4.P$1 73.66,36.83
PWM
  Bottom 0.406: R4.P$2 73.66,23.5 73.03,22.86 59.69,22.86 55.88,19.05 54.88,19.05 IC1.15
R1  (via drill 0.5 pad 1.02)
  Top 0.406: v53.98,31.11 53.98,30.48 54.61,29.84 56.52,29.84 62.23,35.56 62.23,43.81 62.87,44.45 67.94,44.45 68.58,45.09 DISPLAY1.9
  Bottom 0.254: 55.88,21.59 55.63,21.59 IC1.12
  Bottom 0.406: 55.88,21.59 53.98,23.5 v53.98,31.11
SCL  (via drill 0.5 pad 1.02)
  Top 0.406: v48.26,24.77 52.07,20.95 64.77,20.95 65.41,20.32 R5.P$1
  Bottom 0.406: IC4.16 66.04,19.68 65.41,19.05 R5.P$1 | IC1.25 47.06,24.77 v48.26,24.77
SDA  (via drill 0.5 pad 1.02)
  Top 0.406: v46.99,26.04 48.9,26.04 53.34,21.59 67.31,21.59 67.94,20.95 R6.P$1
  Bottom 0.406: IC4.15 68.58,18.41 R6.P$1 | IC1.26 47.2,26.04 v46.99,26.04
VBAT
  Bottom 0.406: IC4.14 79.38,17.14 81.28,19.05 G2.+

### Text on the board
tPlace: VERSI 1